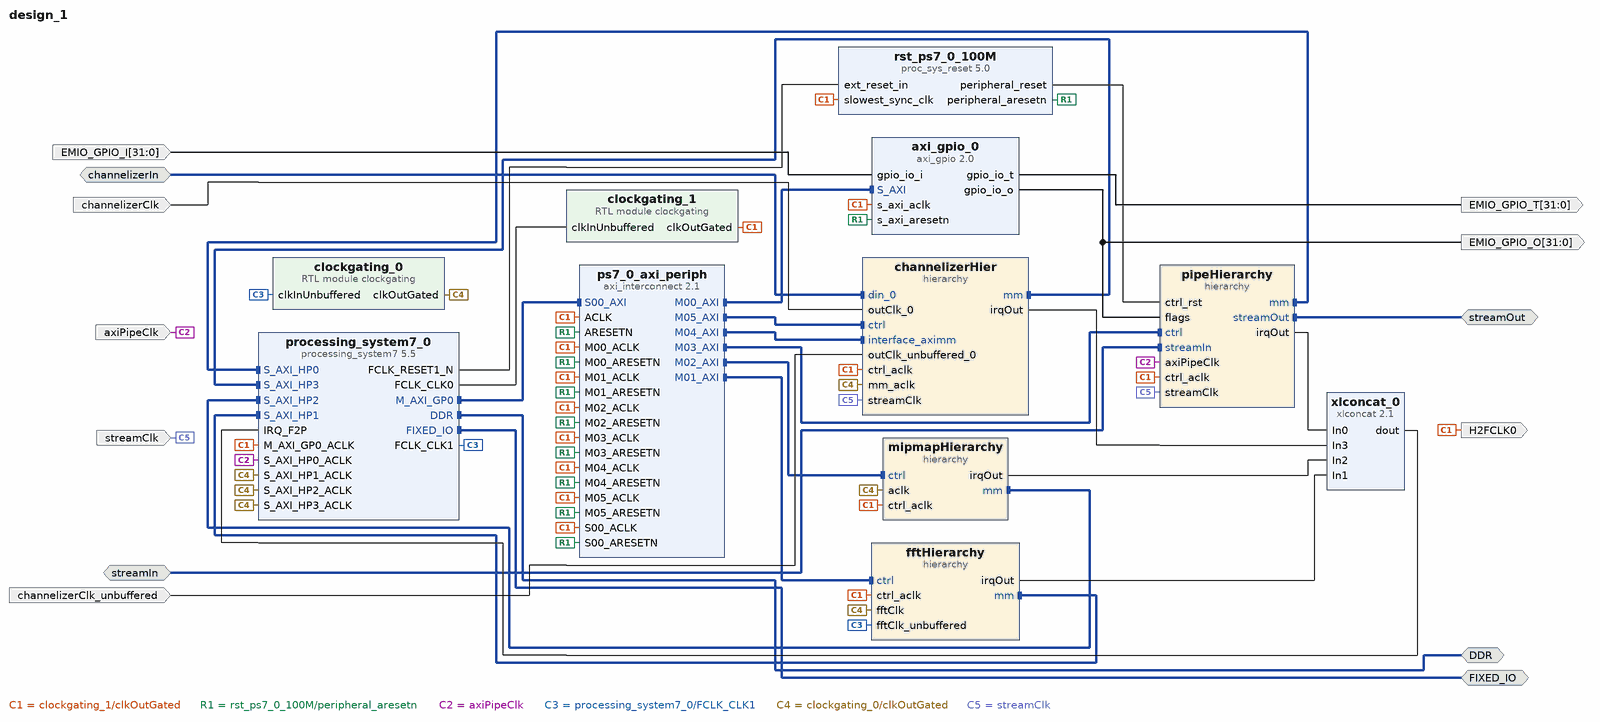
[diagram p0: block diagram of the top level]
# Vivado block design design_1, xc7z010clg400-1, Vivado 2019.1
create_bd_design design_1

create_bd_intf_port -mode Master -vlnv xilinx.com:interface:ddrx_rtl:1.0 DDR
create_bd_intf_port -mode Master -vlnv xilinx.com:display_processing_system7:fixedio_rtl:1.0 FIXED_IO
create_bd_intf_port -mode Slave -vlnv xilinx.com:interface:axis_rtl:1.0 streamIn
set_property -dict [list \
  CONFIG.HAS_TKEEP 0 \
  CONFIG.HAS_TLAST 0 \
  CONFIG.HAS_TREADY 1 \
  CONFIG.HAS_TSTRB 0 \
  CONFIG.LAYERED_METADATA undef \
  CONFIG.TDATA_NUM_BYTES 4 \
  CONFIG.TDEST_WIDTH 0 \
  CONFIG.TID_WIDTH 0 \
  CONFIG.TUSER_WIDTH 0 \
] [get_bd_intf_ports streamIn]
create_bd_intf_port -mode Slave -vlnv xilinx.com:interface:axis_rtl:1.0 channelizerIn
set_property -dict [list \
  CONFIG.HAS_TKEEP 0 \
  CONFIG.HAS_TLAST 0 \
  CONFIG.HAS_TREADY 1 \
  CONFIG.HAS_TSTRB 0 \
  CONFIG.LAYERED_METADATA undef \
  CONFIG.TDATA_NUM_BYTES 3 \
  CONFIG.TDEST_WIDTH 0 \
  CONFIG.TID_WIDTH 0 \
  CONFIG.TUSER_WIDTH 0 \
] [get_bd_intf_ports channelizerIn]
create_bd_intf_port -mode Master -vlnv xilinx.com:interface:axis_rtl:1.0 streamOut
set_property -dict {CONFIG.FREQ_HZ 100000000} [get_bd_intf_ports streamOut]
create_bd_port -dir O -type clk H2FCLK0
create_bd_port -dir O -from 31 -to 0 -type data EMIO_GPIO_O
create_bd_port -dir I -from 31 -to 0 -type data EMIO_GPIO_I
create_bd_port -dir O -from 31 -to 0 -type data EMIO_GPIO_T
create_bd_port -dir I -type clk streamClk
set_property -dict [list \
  CONFIG.ASSOCIATED_BUSIF streamOut:streamIn:channelizerIn:streamOut \
  CONFIG.FREQ_HZ 100000000 \
] [get_bd_ports streamClk]
create_bd_port -dir I -type clk axiPipeClk
set_property -dict {CONFIG.FREQ_HZ 201000000} [get_bd_ports axiPipeClk]
create_bd_port -dir I -type clk channelizerClk
create_bd_port -dir I channelizerClk_unbuffered

create_bd_cell -type ip -vlnv xilinx.com:ip:processing_system7:5.5 processing_system7_0
set_property -dict [list \
  CONFIG.PCW_APU_PERIPHERAL_FREQMHZ 666.666667 \
  CONFIG.PCW_CRYSTAL_PERIPHERAL_FREQMHZ 50 \
  CONFIG.PCW_ENET0_PERIPHERAL_ENABLE 0 \
  CONFIG.PCW_EN_CLK1_PORT 1 \
  CONFIG.PCW_EN_RST0_PORT 0 \
  CONFIG.PCW_EN_RST1_PORT 1 \
  CONFIG.PCW_FCLK_CLK0_BUF FALSE \
  CONFIG.PCW_FPGA0_PERIPHERAL_FREQMHZ 50 \
  CONFIG.PCW_FPGA1_PERIPHERAL_FREQMHZ 200 \
  CONFIG.PCW_FPGA_FCLK1_ENABLE 1 \
  CONFIG.PCW_GPIO_EMIO_GPIO_ENABLE 1 \
  CONFIG.PCW_GPIO_EMIO_GPIO_IO 64 \
  CONFIG.PCW_GPIO_MIO_GPIO_ENABLE 1 \
  CONFIG.PCW_GPIO_MIO_GPIO_IO MIO \
  CONFIG.PCW_GPIO_PERIPHERAL_ENABLE 1 \
  CONFIG.PCW_I2C_RESET_ENABLE 1 \
  CONFIG.PCW_IRQ_F2P_INTR 1 \
  CONFIG.PCW_PERIPHERAL_BOARD_PRESET None \
  CONFIG.PCW_PRESET_BANK1_VOLTAGE {LVCMOS 3.3V} \
  CONFIG.PCW_QSPI_PERIPHERAL_ENABLE 0 \
  CONFIG.PCW_SD0_GRP_CD_ENABLE 0 \
  CONFIG.PCW_SD0_GRP_WP_ENABLE 0 \
  CONFIG.PCW_SD0_PERIPHERAL_ENABLE 1 \
  CONFIG.PCW_SD0_SD0_IO {MIO 40 .. 45} \
  CONFIG.PCW_SDIO_PERIPHERAL_FREQMHZ 50 \
  CONFIG.PCW_UART1_BAUD_RATE 921600 \
  CONFIG.PCW_UART1_PERIPHERAL_ENABLE 1 \
  CONFIG.PCW_UART1_UART1_IO {MIO 48 .. 49} \
  CONFIG.PCW_UART_PERIPHERAL_FREQMHZ 50 \
  CONFIG.PCW_UIPARAM_DDR_FREQ_MHZ 533 \
  CONFIG.PCW_UIPARAM_DDR_PARTNO Custom \
  CONFIG.PCW_USB0_PERIPHERAL_ENABLE 1 \
  CONFIG.PCW_USB0_RESET_ENABLE 1 \
  CONFIG.PCW_USB0_RESET_IO {MIO 20} \
  CONFIG.PCW_USB0_USB0_IO {MIO 28 .. 39} \
  CONFIG.PCW_USB_RESET_ENABLE 1 \
  CONFIG.PCW_USB_RESET_SELECT {Share reset pin} \
  CONFIG.PCW_USE_AXI_NONSECURE 1 \
  CONFIG.PCW_USE_FABRIC_INTERRUPT 1 \
  CONFIG.PCW_USE_S_AXI_HP0 1 \
  CONFIG.PCW_USE_S_AXI_HP1 1 \
  CONFIG.PCW_USE_S_AXI_HP2 1 \
  CONFIG.PCW_USE_S_AXI_HP3 1 \
] [get_bd_cells processing_system7_0]
# 513 more settings of processing_system7_0 are not shown: defaults, MIO pin electricals, DDR timing, and values the tool derives
create_bd_cell -type ip -vlnv xilinx.com:ip:proc_sys_reset:5.0 rst_ps7_0_100M
create_bd_cell -type ip -vlnv xilinx.com:ip:axi_gpio:2.0 axi_gpio_0
create_bd_cell -type hier fftHierarchy
create_bd_cell -type hier mipmapHierarchy
create_bd_cell -type hier pipeHierarchy
create_bd_cell -type ip -vlnv xilinx.com:ip:axi_interconnect:2.1 ps7_0_axi_periph
set_property -dict {CONFIG.NUM_MI 6} [get_bd_cells ps7_0_axi_periph]
create_bd_cell -type module -reference clockgating clockgating_0
create_bd_cell -type module -reference clockgating clockgating_1
create_bd_cell -type ip -vlnv xilinx.com:ip:xlconcat:2.1 xlconcat_0
set_property -dict {CONFIG.NUM_PORTS 4} [get_bd_cells xlconcat_0]
create_bd_cell -type hier channelizerHier

# ---- hierarchy /fftHierarchy ----
current_bd_instance /fftHierarchy
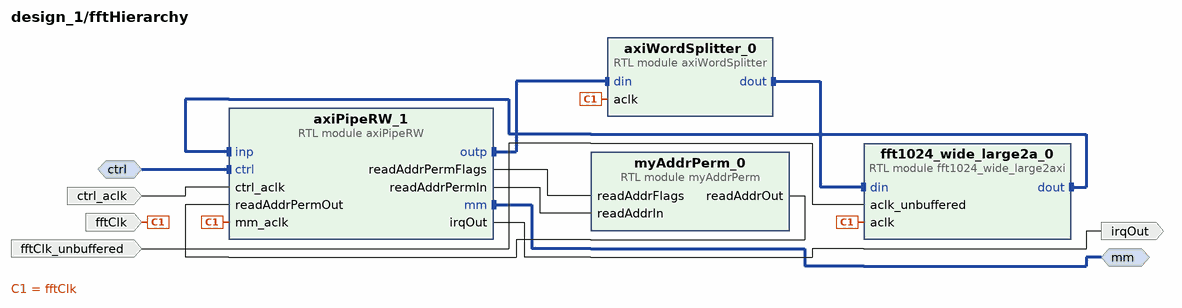
[diagram p1: block diagram inside /fftHierarchy]
create_bd_intf_pin -mode Slave -vlnv xilinx.com:interface:aximm_rtl:1.0 ctrl
create_bd_intf_pin -mode Master -vlnv xilinx.com:interface:aximm_rtl:1.0 mm
create_bd_pin -dir I -type clk ctrl_aclk
create_bd_pin -dir I -type clk fftClk
create_bd_pin -dir I fftClk_unbuffered
create_bd_pin -dir O irqOut

create_bd_cell -type module -reference myAddrPerm myAddrPerm_0
create_bd_cell -type module -reference axiWordSplitter axiWordSplitter_0
set_property -dict {CONFIG.enableFlagNum 5 CONFIG.tuserWidth 7} [get_bd_cells axiWordSplitter_0]
create_bd_cell -type module -reference fft1024_wide_large2axi fft1024_wide_large2a_0
create_bd_cell -type module -reference axiPipeRW axiPipeRW_1
set_property -dict {CONFIG.customReadAddrPermutation true CONFIG.customWriteAddrPermutation false} [get_bd_cells axiPipeRW_1]

# ---- hierarchy /mipmapHierarchy ----
current_bd_instance /mipmapHierarchy
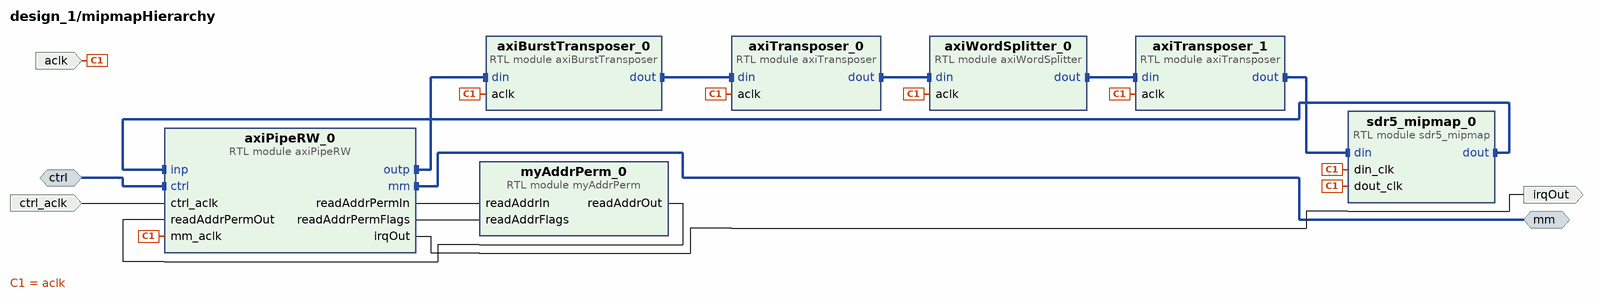
[diagram p2: block diagram inside /mipmapHierarchy]
create_bd_intf_pin -mode Master -vlnv xilinx.com:interface:aximm_rtl:1.0 mm
create_bd_intf_pin -mode Slave -vlnv xilinx.com:interface:aximm_rtl:1.0 ctrl
create_bd_pin -dir I -type clk aclk
create_bd_pin -dir I -type clk ctrl_aclk
create_bd_pin -dir O irqOut

create_bd_cell -type module -reference axiBurstTransposer axiBurstTransposer_0
set_property -dict {CONFIG.doTransposeFlagNum 2 CONFIG.tuserWidth 7 CONFIG.width 64} [get_bd_cells axiBurstTransposer_0]
create_bd_cell -type module -reference axiTransposer axiTransposer_0
set_property -dict [list \
  CONFIG.colsOrder 1 \
  CONFIG.doTransposeFlagNum 3 \
  CONFIG.rowsOrder 10 \
  CONFIG.swapRowColSizeFlagNum 4 \
  CONFIG.tuserWidth 7 \
  CONFIG.wordWidth 64 \
] [get_bd_cells axiTransposer_0]
create_bd_cell -type module -reference axiWordSplitter axiWordSplitter_0
set_property -dict {CONFIG.enableFlagNum 5 CONFIG.tuserWidth 7} [get_bd_cells axiWordSplitter_0]
create_bd_cell -type module -reference axiTransposer axiTransposer_1
set_property -dict [list \
  CONFIG.colsOrder 1 \
  CONFIG.doTransposeFlagNum 6 \
  CONFIG.rowsOrder 10 \
  CONFIG.swapRowColSizeFlagNum 4 \
  CONFIG.tuserWidth 7 \
  CONFIG.wordWidth 64 \
] [get_bd_cells axiTransposer_1]
create_bd_cell -type module -reference myAddrPerm myAddrPerm_0
create_bd_cell -type module -reference sdr5_mipmap sdr5_mipmap_0
create_bd_cell -type module -reference axiPipeRW axiPipeRW_0
set_property -dict {CONFIG.customReadAddrPermutation true CONFIG.interleaveColBits 8} [get_bd_cells axiPipeRW_0]

# ---- hierarchy /pipeHierarchy ----
current_bd_instance /pipeHierarchy
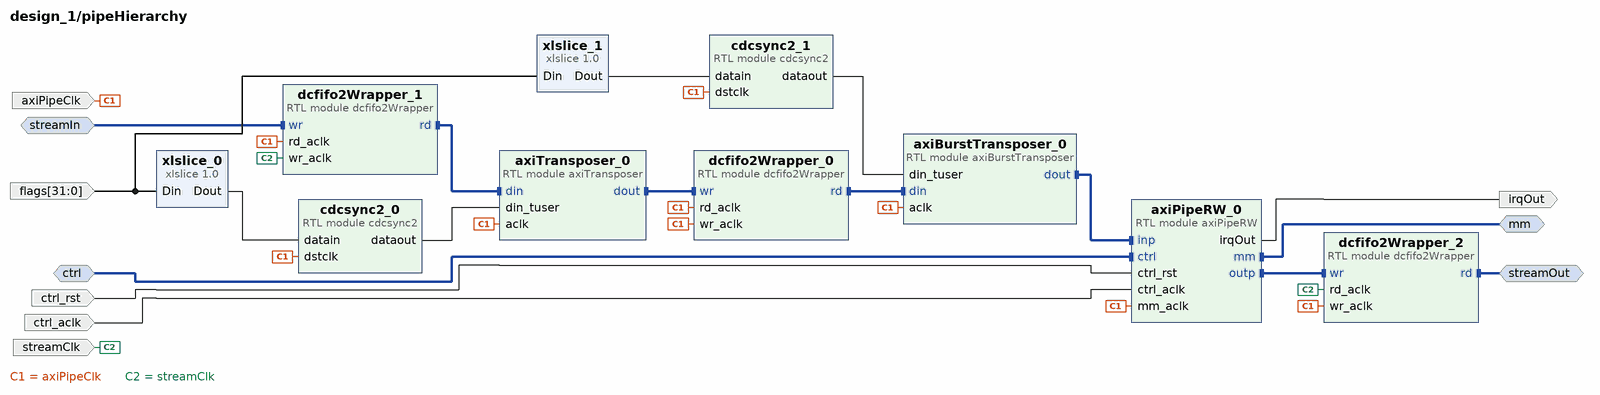
[diagram p3: block diagram inside /pipeHierarchy]
create_bd_intf_pin -mode Master -vlnv xilinx.com:interface:aximm_rtl:1.0 mm
create_bd_intf_pin -mode Slave -vlnv xilinx.com:interface:aximm_rtl:1.0 ctrl
create_bd_intf_pin -mode Slave -vlnv xilinx.com:interface:axis_rtl:1.0 streamIn
create_bd_intf_pin -mode Master -vlnv xilinx.com:interface:axis_rtl:1.0 streamOut
create_bd_pin -dir I -type rst ctrl_rst
create_bd_pin -dir I -type clk ctrl_aclk
create_bd_pin -dir I -type clk streamClk
create_bd_pin -dir I -type clk axiPipeClk
create_bd_pin -dir O irqOut
create_bd_pin -dir I -from 31 -to 0 flags

create_bd_cell -type module -reference axiTransposer axiTransposer_0
set_property -dict {CONFIG.colsOrder 10 CONFIG.rowsOrder 2 CONFIG.tuserWidth 2 CONFIG.wordWidth 32} [get_bd_cells axiTransposer_0]
create_bd_cell -type module -reference axiBurstTransposer axiBurstTransposer_0
set_property -dict {CONFIG.tuserWidth 1 CONFIG.width 64} [get_bd_cells axiBurstTransposer_0]
create_bd_cell -type ip -vlnv xilinx.com:ip:xlslice:1.0 xlslice_0
set_property -dict {CONFIG.DIN_FROM 15 CONFIG.DIN_TO 14 CONFIG.DOUT_WIDTH 2} [get_bd_cells xlslice_0]
create_bd_cell -type ip -vlnv xilinx.com:ip:xlslice:1.0 xlslice_1
set_property -dict {CONFIG.DIN_FROM 13 CONFIG.DIN_TO 13 CONFIG.DOUT_WIDTH 1} [get_bd_cells xlslice_1]
create_bd_cell -type module -reference cdcsync2 cdcsync2_0
set_property -dict {CONFIG.width 2} [get_bd_cells cdcsync2_0]
create_bd_cell -type module -reference cdcsync2 cdcsync2_1
set_property -dict {CONFIG.width 1} [get_bd_cells cdcsync2_1]
create_bd_cell -type module -reference dcfifo2Wrapper dcfifo2Wrapper_0
set_property -dict [list \
  CONFIG.depthOrderIn 6 \
  CONFIG.depthOrderOut 5 \
  CONFIG.widthIn 32 \
  CONFIG.widthOut 64 \
] [get_bd_cells dcfifo2Wrapper_0]
create_bd_cell -type module -reference dcfifo2Wrapper dcfifo2Wrapper_1
set_property -dict [list \
  CONFIG.depthOrderIn 11 \
  CONFIG.depthOrderOut 11 \
  CONFIG.widthIn 32 \
  CONFIG.widthOut 32 \
] [get_bd_cells dcfifo2Wrapper_1]
create_bd_cell -type module -reference dcfifo2Wrapper dcfifo2Wrapper_2
set_property -dict {CONFIG.depthOrderOut 10 CONFIG.widthIn 64 CONFIG.widthOut 32} [get_bd_cells dcfifo2Wrapper_2]
create_bd_cell -type module -reference axiPipeRW axiPipeRW_0
set_property -dict {CONFIG.interleaveColBits 8} [get_bd_cells axiPipeRW_0]

# ---- hierarchy /channelizerHier ----
current_bd_instance /channelizerHier
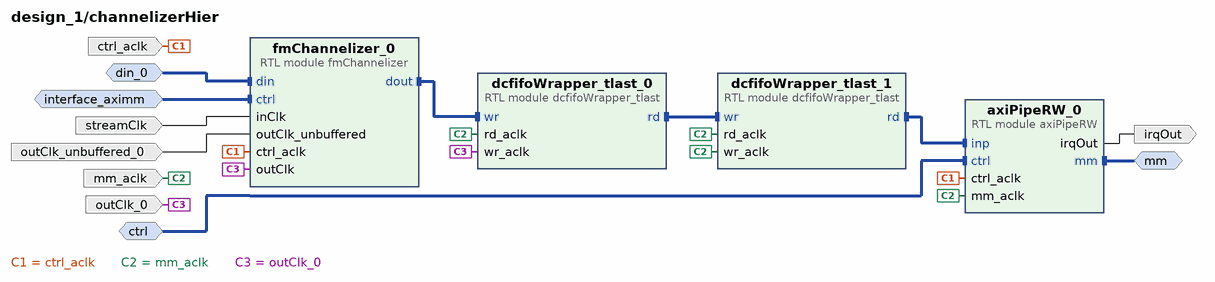
[diagram p4: block diagram inside /channelizerHier]
create_bd_intf_pin -mode Slave -vlnv xilinx.com:interface:aximm_rtl:1.0 interface_aximm
create_bd_intf_pin -mode Slave -vlnv xilinx.com:interface:aximm_rtl:1.0 ctrl
create_bd_intf_pin -mode Master -vlnv xilinx.com:interface:aximm_rtl:1.0 mm
create_bd_intf_pin -mode Slave -vlnv xilinx.com:interface:axis_rtl:1.0 din_0
create_bd_pin -dir I streamClk
create_bd_pin -dir I -type clk ctrl_aclk
create_bd_pin -dir I -type clk mm_aclk
create_bd_pin -dir O irqOut
create_bd_pin -dir I -type clk outClk_0
create_bd_pin -dir I outClk_unbuffered_0

create_bd_cell -type module -reference dcfifoWrapper_tlast dcfifoWrapper_tlast_0
set_property -dict {CONFIG.depthOrder 5 CONFIG.width 64} [get_bd_cells dcfifoWrapper_tlast_0]
create_bd_cell -type module -reference dcfifoWrapper_tlast dcfifoWrapper_tlast_1
set_property -dict {CONFIG.width 64} [get_bd_cells dcfifoWrapper_tlast_1]
create_bd_cell -type module -reference fmChannelizer fmChannelizer_0
set_property -dict {CONFIG.inBits 12 CONFIG.outBits 24 CONFIG.ramDepthOrder 5} [get_bd_cells fmChannelizer_0]
create_bd_cell -type module -reference axiPipeRW axiPipeRW_0

# ---- connections ----

current_bd_instance /fftHierarchy
connect_bd_intf_net [get_bd_intf_pins fft1024_wide_large2a_0/dout] [get_bd_intf_pins axiPipeRW_1/inp]
connect_bd_intf_net [get_bd_intf_pins mm] [get_bd_intf_pins axiPipeRW_1/mm]
connect_bd_intf_net [get_bd_intf_pins axiPipeRW_1/outp] [get_bd_intf_pins axiWordSplitter_0/din]
connect_bd_intf_net [get_bd_intf_pins axiWordSplitter_0/dout] [get_bd_intf_pins fft1024_wide_large2a_0/din]
connect_bd_intf_net [get_bd_intf_pins ctrl] [get_bd_intf_pins axiPipeRW_1/ctrl]
connect_bd_net [get_bd_pins ctrl_aclk] [get_bd_pins axiPipeRW_1/ctrl_aclk]
connect_bd_net [get_bd_pins fftClk] [get_bd_pins axiWordSplitter_0/aclk] [get_bd_pins fft1024_wide_large2a_0/aclk] [get_bd_pins axiPipeRW_1/mm_aclk]
connect_bd_net [get_bd_pins fftClk_unbuffered] [get_bd_pins fft1024_wide_large2a_0/aclk_unbuffered]
connect_bd_net [get_bd_pins myAddrPerm_0/readAddrOut] [get_bd_pins axiPipeRW_1/readAddrPermOut]
connect_bd_net [get_bd_pins axiPipeRW_1/readAddrPermFlags] [get_bd_pins myAddrPerm_0/readAddrFlags]
connect_bd_net [get_bd_pins axiPipeRW_1/readAddrPermIn] [get_bd_pins myAddrPerm_0/readAddrIn]
connect_bd_net [get_bd_pins axiPipeRW_1/irqOut] [get_bd_pins irqOut]

current_bd_instance /mipmapHierarchy
connect_bd_intf_net [get_bd_intf_pins axiPipeRW_0/outp] [get_bd_intf_pins axiBurstTransposer_0/din]
connect_bd_intf_net [get_bd_intf_pins sdr5_mipmap_0/dout] [get_bd_intf_pins axiPipeRW_0/inp]
connect_bd_intf_net [get_bd_intf_pins axiTransposer_1/dout] [get_bd_intf_pins sdr5_mipmap_0/din]
connect_bd_intf_net [get_bd_intf_pins ctrl] [get_bd_intf_pins axiPipeRW_0/ctrl]
connect_bd_intf_net [get_bd_intf_pins axiTransposer_0/dout] [get_bd_intf_pins axiWordSplitter_0/din]
connect_bd_intf_net [get_bd_intf_pins axiWordSplitter_0/dout] [get_bd_intf_pins axiTransposer_1/din]
connect_bd_intf_net [get_bd_intf_pins mm] [get_bd_intf_pins axiPipeRW_0/mm]
connect_bd_intf_net [get_bd_intf_pins axiBurstTransposer_0/dout] [get_bd_intf_pins axiTransposer_0/din]
connect_bd_net [get_bd_pins aclk] \
  [get_bd_pins axiBurstTransposer_0/aclk] [get_bd_pins axiTransposer_0/aclk] [get_bd_pins axiWordSplitter_0/aclk] \
  [get_bd_pins axiTransposer_1/aclk] [get_bd_pins sdr5_mipmap_0/din_clk] [get_bd_pins sdr5_mipmap_0/dout_clk] \
  [get_bd_pins axiPipeRW_0/mm_aclk]
connect_bd_net [get_bd_pins ctrl_aclk] [get_bd_pins axiPipeRW_0/ctrl_aclk]
connect_bd_net [get_bd_pins axiPipeRW_0/irqOut] [get_bd_pins irqOut]
connect_bd_net [get_bd_pins axiPipeRW_0/readAddrPermIn] [get_bd_pins myAddrPerm_0/readAddrIn]
connect_bd_net [get_bd_pins axiPipeRW_0/readAddrPermFlags] [get_bd_pins myAddrPerm_0/readAddrFlags]
connect_bd_net [get_bd_pins myAddrPerm_0/readAddrOut] [get_bd_pins axiPipeRW_0/readAddrPermOut]

current_bd_instance /pipeHierarchy
connect_bd_intf_net [get_bd_intf_pins axiBurstTransposer_0/dout] [get_bd_intf_pins axiPipeRW_0/inp]
connect_bd_intf_net [get_bd_intf_pins mm] [get_bd_intf_pins axiPipeRW_0/mm]
connect_bd_intf_net [get_bd_intf_pins streamIn] [get_bd_intf_pins dcfifo2Wrapper_1/wr]
connect_bd_intf_net [get_bd_intf_pins dcfifo2Wrapper_1/rd] [get_bd_intf_pins axiTransposer_0/din]
connect_bd_intf_net [get_bd_intf_pins ctrl] [get_bd_intf_pins axiPipeRW_0/ctrl]
connect_bd_intf_net [get_bd_intf_pins axiTransposer_0/dout] [get_bd_intf_pins dcfifo2Wrapper_0/wr]
connect_bd_intf_net [get_bd_intf_pins dcfifo2Wrapper_0/rd] [get_bd_intf_pins axiBurstTransposer_0/din]
connect_bd_intf_net [get_bd_intf_pins dcfifo2Wrapper_2/wr] [get_bd_intf_pins axiPipeRW_0/outp]
connect_bd_intf_net [get_bd_intf_pins streamOut] [get_bd_intf_pins dcfifo2Wrapper_2/rd]
connect_bd_net [get_bd_pins ctrl_rst] [get_bd_pins axiPipeRW_0/ctrl_rst]
connect_bd_net [get_bd_pins ctrl_aclk] [get_bd_pins axiPipeRW_0/ctrl_aclk]
connect_bd_net [get_bd_pins axiPipeClk] \
  [get_bd_pins axiBurstTransposer_0/aclk] [get_bd_pins cdcsync2_1/dstclk] [get_bd_pins axiTransposer_0/aclk] \
  [get_bd_pins cdcsync2_0/dstclk] [get_bd_pins dcfifo2Wrapper_0/rd_aclk] [get_bd_pins dcfifo2Wrapper_0/wr_aclk] \
  [get_bd_pins dcfifo2Wrapper_1/rd_aclk] [get_bd_pins dcfifo2Wrapper_2/wr_aclk] [get_bd_pins axiPipeRW_0/mm_aclk]
connect_bd_net [get_bd_pins axiPipeRW_0/irqOut] [get_bd_pins irqOut]
connect_bd_net [get_bd_pins xlslice_0/Dout] [get_bd_pins cdcsync2_0/datain]
connect_bd_net [get_bd_pins flags] [get_bd_pins xlslice_0/Din] [get_bd_pins xlslice_1/Din]
connect_bd_net [get_bd_pins cdcsync2_0/dataout] [get_bd_pins axiTransposer_0/din_tuser]
connect_bd_net [get_bd_pins xlslice_1/Dout] [get_bd_pins cdcsync2_1/datain]
connect_bd_net [get_bd_pins cdcsync2_1/dataout] [get_bd_pins axiBurstTransposer_0/din_tuser]
connect_bd_net [get_bd_pins streamClk] [get_bd_pins dcfifo2Wrapper_1/wr_aclk] [get_bd_pins dcfifo2Wrapper_2/rd_aclk]

current_bd_instance /channelizerHier
connect_bd_intf_net [get_bd_intf_pins mm] [get_bd_intf_pins axiPipeRW_0/mm]
connect_bd_intf_net [get_bd_intf_pins dcfifoWrapper_tlast_0/rd] [get_bd_intf_pins dcfifoWrapper_tlast_1/wr]
connect_bd_intf_net [get_bd_intf_pins fmChannelizer_0/dout] [get_bd_intf_pins dcfifoWrapper_tlast_0/wr]
connect_bd_intf_net [get_bd_intf_pins ctrl] [get_bd_intf_pins axiPipeRW_0/ctrl]
connect_bd_intf_net [get_bd_intf_pins dcfifoWrapper_tlast_1/rd] [get_bd_intf_pins axiPipeRW_0/inp]
connect_bd_intf_net [get_bd_intf_pins din_0] [get_bd_intf_pins fmChannelizer_0/din]
connect_bd_intf_net [get_bd_intf_pins interface_aximm] [get_bd_intf_pins fmChannelizer_0/ctrl]
connect_bd_net [get_bd_pins streamClk] [get_bd_pins fmChannelizer_0/inClk]
connect_bd_net [get_bd_pins ctrl_aclk] [get_bd_pins fmChannelizer_0/ctrl_aclk] [get_bd_pins axiPipeRW_0/ctrl_aclk]
connect_bd_net [get_bd_pins mm_aclk] \
  [get_bd_pins dcfifoWrapper_tlast_0/rd_aclk] [get_bd_pins dcfifoWrapper_tlast_1/wr_aclk] \
  [get_bd_pins dcfifoWrapper_tlast_1/rd_aclk] [get_bd_pins axiPipeRW_0/mm_aclk]
connect_bd_net [get_bd_pins axiPipeRW_0/irqOut] [get_bd_pins irqOut]
connect_bd_net -net outClk_0_1 [get_bd_pins outClk_0] [get_bd_pins dcfifoWrapper_tlast_0/wr_aclk] [get_bd_pins fmChannelizer_0/outClk]
connect_bd_net -net outClk_unbuffered_0_1 [get_bd_pins outClk_unbuffered_0] [get_bd_pins fmChannelizer_0/outClk_unbuffered]

current_bd_instance /
connect_bd_intf_net -intf_net pipeHierarchy_outp_0 [get_bd_intf_ports streamOut] [get_bd_intf_pins pipeHierarchy/streamOut]
connect_bd_intf_net [get_bd_intf_pins ps7_0_axi_periph/M00_AXI] [get_bd_intf_pins axi_gpio_0/S_AXI]
connect_bd_intf_net [get_bd_intf_pins processing_system7_0/S_AXI_HP0] [get_bd_intf_pins pipeHierarchy/mm]
connect_bd_intf_net [get_bd_intf_pins processing_system7_0/M_AXI_GP0] [get_bd_intf_pins ps7_0_axi_periph/S00_AXI]
connect_bd_intf_net [get_bd_intf_pins ps7_0_axi_periph/M05_AXI] [get_bd_intf_pins channelizerHier/ctrl]
connect_bd_intf_net [get_bd_intf_pins processing_system7_0/S_AXI_HP3] [get_bd_intf_pins channelizerHier/mm]
connect_bd_intf_net [get_bd_intf_pins ps7_0_axi_periph/M01_AXI] [get_bd_intf_pins fftHierarchy/ctrl]
connect_bd_intf_net [get_bd_intf_ports DDR] [get_bd_intf_pins processing_system7_0/DDR]
connect_bd_intf_net [get_bd_intf_ports FIXED_IO] [get_bd_intf_pins processing_system7_0/FIXED_IO]
connect_bd_intf_net -intf_net din_0_1 [get_bd_intf_ports channelizerIn] [get_bd_intf_pins channelizerHier/din_0]
connect_bd_intf_net [get_bd_intf_pins ps7_0_axi_periph/M03_AXI] [get_bd_intf_pins pipeHierarchy/ctrl]
connect_bd_intf_net [get_bd_intf_pins ps7_0_axi_periph/M04_AXI] [get_bd_intf_pins channelizerHier/interface_aximm]
connect_bd_intf_net [get_bd_intf_pins processing_system7_0/S_AXI_HP2] [get_bd_intf_pins mipmapHierarchy/mm]
connect_bd_intf_net [get_bd_intf_pins processing_system7_0/S_AXI_HP1] [get_bd_intf_pins fftHierarchy/mm]
connect_bd_intf_net -intf_net wr_1_1 [get_bd_intf_ports streamIn] [get_bd_intf_pins pipeHierarchy/streamIn]
connect_bd_intf_net [get_bd_intf_pins ps7_0_axi_periph/M02_AXI] [get_bd_intf_pins mipmapHierarchy/ctrl]
connect_bd_net -net processing_system7_0_FCLK_CLK0 [get_bd_pins clockgating_1/clkOutGated] \
  [get_bd_pins processing_system7_0/M_AXI_GP0_ACLK] [get_bd_ports H2FCLK0] [get_bd_pins rst_ps7_0_100M/slowest_sync_clk] \
  [get_bd_pins axi_gpio_0/s_axi_aclk] [get_bd_pins fftHierarchy/ctrl_aclk] [get_bd_pins mipmapHierarchy/ctrl_aclk] \
  [get_bd_pins pipeHierarchy/ctrl_aclk] [get_bd_pins ps7_0_axi_periph/ACLK] [get_bd_pins ps7_0_axi_periph/S00_ACLK] \
  [get_bd_pins ps7_0_axi_periph/M00_ACLK] [get_bd_pins ps7_0_axi_periph/M01_ACLK] [get_bd_pins ps7_0_axi_periph/M02_ACLK] \
  [get_bd_pins ps7_0_axi_periph/M03_ACLK] [get_bd_pins channelizerHier/ctrl_aclk] [get_bd_pins ps7_0_axi_periph/M04_ACLK] \
  [get_bd_pins ps7_0_axi_periph/M05_ACLK]
connect_bd_net [get_bd_pins processing_system7_0/FCLK_RESET1_N] [get_bd_pins rst_ps7_0_100M/ext_reset_in]
connect_bd_net -net rst_ps7_0_200M_peripheral_aresetn [get_bd_pins rst_ps7_0_100M/peripheral_aresetn] \
  [get_bd_pins axi_gpio_0/s_axi_aresetn] [get_bd_pins ps7_0_axi_periph/S00_ARESETN] \
  [get_bd_pins ps7_0_axi_periph/M00_ARESETN] [get_bd_pins ps7_0_axi_periph/ARESETN] \
  [get_bd_pins ps7_0_axi_periph/M01_ARESETN] [get_bd_pins ps7_0_axi_periph/M02_ARESETN] \
  [get_bd_pins ps7_0_axi_periph/M03_ARESETN] [get_bd_pins ps7_0_axi_periph/M04_ARESETN] \
  [get_bd_pins ps7_0_axi_periph/M05_ARESETN]
connect_bd_net [get_bd_ports EMIO_GPIO_I] [get_bd_pins axi_gpio_0/gpio_io_i]
connect_bd_net [get_bd_pins axi_gpio_0/gpio_io_o] [get_bd_ports EMIO_GPIO_O] [get_bd_pins pipeHierarchy/flags]
connect_bd_net [get_bd_pins axi_gpio_0/gpio_io_t] [get_bd_ports EMIO_GPIO_T]
connect_bd_net [get_bd_ports axiPipeClk] [get_bd_pins processing_system7_0/S_AXI_HP0_ACLK] [get_bd_pins pipeHierarchy/axiPipeClk]
connect_bd_net [get_bd_pins processing_system7_0/FCLK_CLK1] [get_bd_pins fftHierarchy/fftClk_unbuffered] [get_bd_pins clockgating_0/clkInUnbuffered]
connect_bd_net [get_bd_pins clockgating_0/clkOutGated] \
  [get_bd_pins fftHierarchy/fftClk] [get_bd_pins processing_system7_0/S_AXI_HP1_ACLK] \
  [get_bd_pins processing_system7_0/S_AXI_HP2_ACLK] [get_bd_pins mipmapHierarchy/aclk] \
  [get_bd_pins processing_system7_0/S_AXI_HP3_ACLK] [get_bd_pins channelizerHier/mm_aclk]
connect_bd_net [get_bd_pins rst_ps7_0_100M/peripheral_reset] [get_bd_pins pipeHierarchy/ctrl_rst]
connect_bd_net [get_bd_ports streamClk] [get_bd_pins pipeHierarchy/streamClk] [get_bd_pins channelizerHier/streamClk]
connect_bd_net [get_bd_pins processing_system7_0/FCLK_CLK0] [get_bd_pins clockgating_1/clkInUnbuffered]
connect_bd_net [get_bd_pins xlconcat_0/dout] [get_bd_pins processing_system7_0/IRQ_F2P]
connect_bd_net [get_bd_pins pipeHierarchy/irqOut] [get_bd_pins xlconcat_0/In0]
connect_bd_net [get_bd_pins fftHierarchy/irqOut] [get_bd_pins xlconcat_0/In1]
connect_bd_net [get_bd_pins mipmapHierarchy/irqOut] [get_bd_pins xlconcat_0/In2]
connect_bd_net [get_bd_pins channelizerHier/irqOut] [get_bd_pins xlconcat_0/In3]
connect_bd_net -net outClk_0_1 [get_bd_ports channelizerClk] [get_bd_pins channelizerHier/outClk_0]
connect_bd_net -net outClk_unbuffered_0_1 [get_bd_ports channelizerClk_unbuffered] [get_bd_pins channelizerHier/outClk_unbuffered_0]

# ---- address map ----
assign_bd_address -offset 0x00000000 -range 1G -target_address_space [get_bd_addr_spaces channelizerHier/axiPipeRW_0/mm] [get_bd_addr_segs processing_system7_0/S_AXI_HP3/HP3_DDR_LOWOCM]
assign_bd_address -offset 0x00000000 -range 1G -target_address_space [get_bd_addr_spaces fftHierarchy/axiPipeRW_1/mm] [get_bd_addr_segs processing_system7_0/S_AXI_HP1/HP1_DDR_LOWOCM]
assign_bd_address -offset 0x00000000 -range 1G -target_address_space [get_bd_addr_spaces mipmapHierarchy/axiPipeRW_0/mm] [get_bd_addr_segs processing_system7_0/S_AXI_HP2/HP2_DDR_LOWOCM]
assign_bd_address -offset 0x00000000 -range 1G -target_address_space [get_bd_addr_spaces pipeHierarchy/axiPipeRW_0/mm] [get_bd_addr_segs processing_system7_0/S_AXI_HP0/HP0_DDR_LOWOCM]
assign_bd_address -offset 0x41200000 -range 64K -target_address_space [get_bd_addr_spaces processing_system7_0/Data] [get_bd_addr_segs axi_gpio_0/S_AXI/Reg]
assign_bd_address -offset 0x43C00000 -range 64K -target_address_space [get_bd_addr_spaces processing_system7_0/Data] [get_bd_addr_segs pipeHierarchy/axiPipeRW_0/ctrl/reg0]
assign_bd_address -offset 0x43C10000 -range 64K -target_address_space [get_bd_addr_spaces processing_system7_0/Data] [get_bd_addr_segs fftHierarchy/axiPipeRW_1/ctrl/reg0]
assign_bd_address -offset 0x43C20000 -range 64K -target_address_space [get_bd_addr_spaces processing_system7_0/Data] [get_bd_addr_segs mipmapHierarchy/axiPipeRW_0/ctrl/reg0]
assign_bd_address -offset 0x43C30000 -range 64K -target_address_space [get_bd_addr_spaces processing_system7_0/Data] [get_bd_addr_segs channelizerHier/axiPipeRW_0/ctrl/reg0]
assign_bd_address -offset 0x43C40000 -range 64K -target_address_space [get_bd_addr_spaces processing_system7_0/Data] [get_bd_addr_segs channelizerHier/fmChannelizer_0/ctrl/reg0]

validate_bd_design
save_bd_design
